# Altium schematic sheet [4] Signals.SchDoc
size A4; SheetNumber: 5; SheetTotal: 6
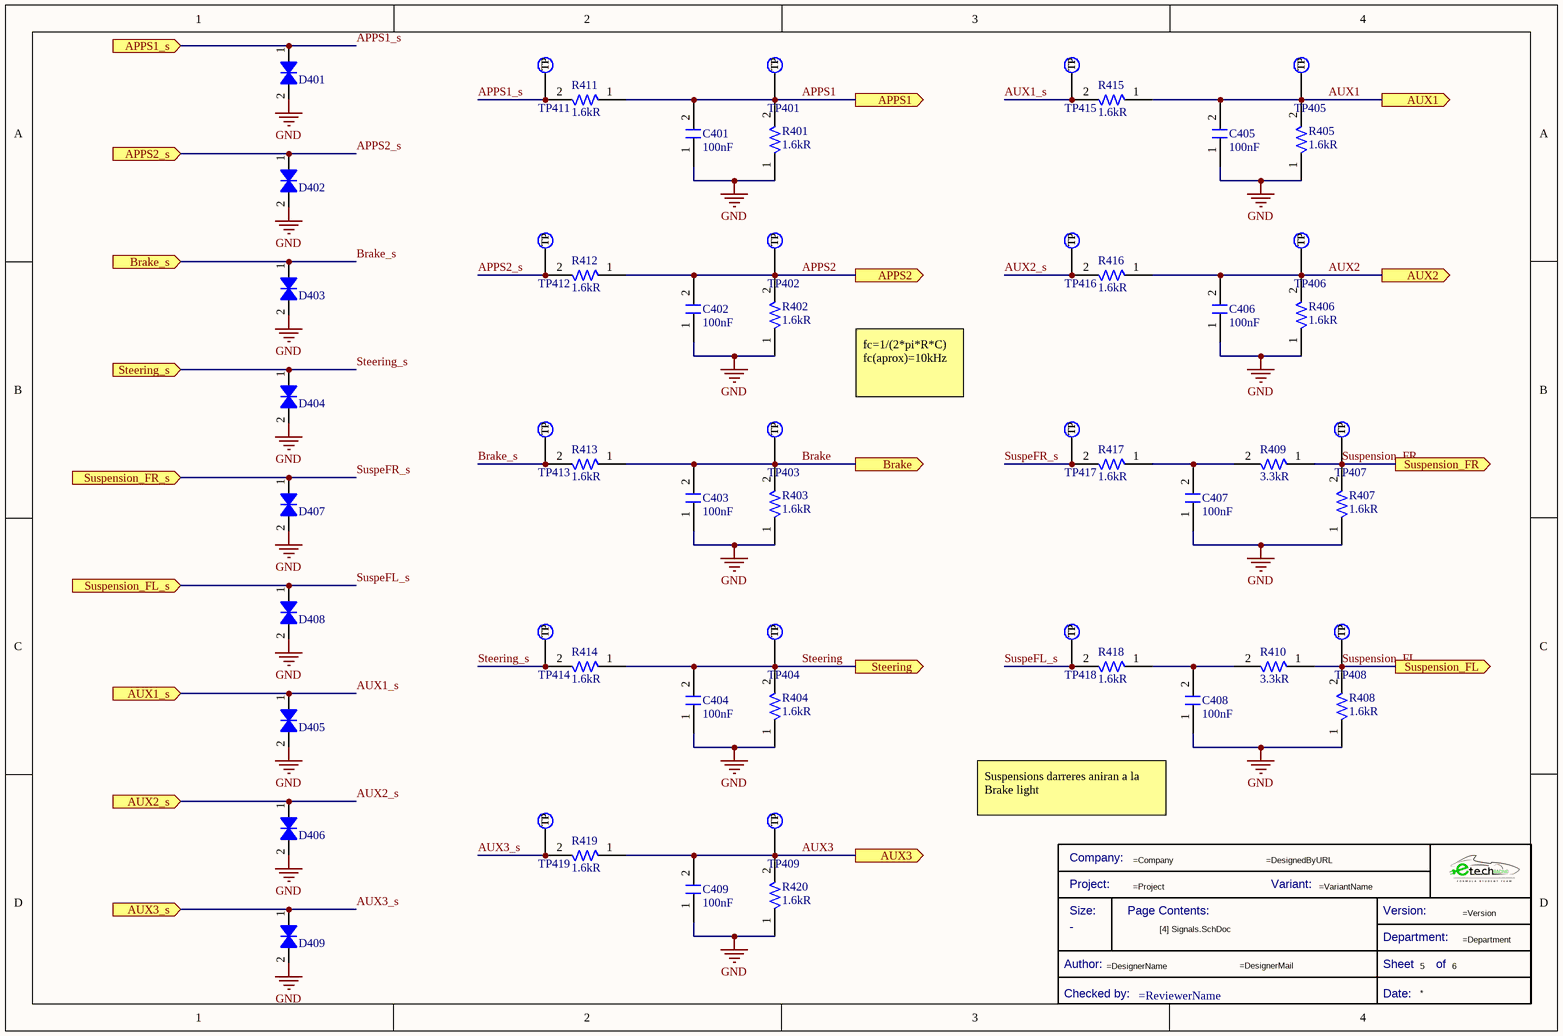
[diagram p0: [4] Signals.SchDoc]

## Parts
*  Title Block_template  (value not drawn)  (graphical)
C401  Capacitance: 100nF  [C1206FNPC-RW]  (hidden comment: 885012208009)
C402  Capacitance: 100nF  [C1206FNPC-RW]  (hidden comment: 885012208009)
C403  Capacitance: 100nF  [C1206FNPC-RW]  (hidden comment: 885012208009)
C404  Capacitance: 100nF  [C1206FNPC-RW]  (hidden comment: 885012208009)
C405  Capacitance: 100nF  [C1206FNPC-RW]  (hidden comment: 885012208009)
C406  Capacitance: 100nF  [C1206FNPC-RW]  (hidden comment: 885012208009)
C407  Capacitance: 100nF  [C1206FNPC-RW]  (hidden comment: 885012208009)
C408  Capacitance: 100nF  [C1206FNPC-RW]  (hidden comment: 885012208009)
C409  Capacitance: 100nF  [C1206FNPC-RW]  (hidden comment: 885012208009)
D401  824501600  [DTVS-DO-214AC]  (value not drawn)
D402  824501600  [DTVS-DO-214AC]  (value not drawn)
D403  824501600  [DTVS-DO-214AC]  (value not drawn)
D404  824501600  [DTVS-DO-214AC]  (value not drawn)
D405  824501600  [DTVS-DO-214AC]  (value not drawn)
D406  824501600  [DTVS-DO-214AC]  (value not drawn)
D407  824501600  [DTVS-DO-214AC]  (value not drawn)
D408  824501600  [DTVS-DO-214AC]  (value not drawn)
D409  824501600  [DTVS-DO-214AC]  (value not drawn)
R401  Resistance: 1.6kR  [R1206FTK-W]  (hidden comment: CRCW12061K60FKEA)
R402  Resistance: 1.6kR  [R1206FTK-W]  (hidden comment: CRCW12061K60FKEA)
R403  Resistance: 1.6kR  [R1206FTK-W]  (hidden comment: CRCW12061K60FKEA)
R404  Resistance: 1.6kR  [R1206FTK-W]  (hidden comment: CRCW12061K60FKEA)
R405  Resistance: 1.6kR  [R1206FTK-W]  (hidden comment: CRCW12061K60FKEA)
R406  Resistance: 1.6kR  [R1206FTK-W]  (hidden comment: CRCW12061K60FKEA)
R407  Resistance: 1.6kR  [R1206FTK-W]  (hidden comment: CRCW12064K30FKEA)
R408  Resistance: 1.6kR  [R1206FTK-W]  (hidden comment: CRCW12064K30FKEA)
R409  Resistance: 3.3kR  [R1206FTK-W]  (hidden comment: CRCW12066K19FKEA)
R410  Resistance: 3.3kR  [R1206FTK-W]  (hidden comment: CRCW12066K19FKEA)
R411  Resistance: 1.6kR  [R1206FTK-W]  (hidden comment: CRCW12061K60FKEA)
R412  Resistance: 1.6kR  [R1206FTK-W]  (hidden comment: CRCW12061K60FKEA)
R413  Resistance: 1.6kR  [R1206FTK-W]  (hidden comment: CRCW12061K60FKEA)
R414  Resistance: 1.6kR  [R1206FTK-W]  (hidden comment: CRCW12061K60FKEA)
R415  Resistance: 1.6kR  [R1206FTK-W]  (hidden comment: CRCW12061K60FKEA)
R416  Resistance: 1.6kR  [R1206FTK-W]  (hidden comment: CRCW12061K60FKEA)
R417  Resistance: 1.6kR  [R1206FTK-W]  (hidden comment: CRCW12061K60FKEA)
R418  Resistance: 1.6kR  [R1206FTK-W]  (hidden comment: CRCW12061K60FKEA)
R419  Resistance: 1.6kR  [R1206FTK-W]  (hidden comment: CRCW12061K60FKEA)
R420  Resistance: 1.6kR  [R1206FTK-W]  (hidden comment: CRCW12061K60FKEA)
TP401  TestPoint  [TestPoint]  (value not drawn)  (no BOM)
TP402  TestPoint  [TestPoint]  (value not drawn)  (no BOM)
TP403  TestPoint  [TestPoint]  (value not drawn)  (no BOM)
TP404  TestPoint  [TestPoint]  (value not drawn)  (no BOM)
TP405  TestPoint  [TestPoint]  (value not drawn)  (no BOM)
TP406  TestPoint  [TestPoint]  (value not drawn)  (no BOM)
TP407  TestPoint  [TestPoint]  (value not drawn)  (no BOM)
TP408  TestPoint  [TestPoint]  (value not drawn)  (no BOM)
TP409  TestPoint  [TestPoint]  (value not drawn)  (no BOM)
TP411  TestPoint  [TestPoint]  (value not drawn)  (no BOM)
TP412  TestPoint  [TestPoint]  (value not drawn)  (no BOM)
TP413  TestPoint  [TestPoint]  (value not drawn)  (no BOM)
TP414  TestPoint  [TestPoint]  (value not drawn)  (no BOM)
TP415  TestPoint  [TestPoint]  (value not drawn)  (no BOM)
TP416  TestPoint  [TestPoint]  (value not drawn)  (no BOM)
TP417  TestPoint  [TestPoint]  (value not drawn)  (no BOM)
TP418  TestPoint  [TestPoint]  (value not drawn)  (no BOM)
TP419  TestPoint  [TestPoint]  (value not drawn)  (no BOM)

## Ports
APPS1 (out), APPS1_s (in), APPS2 (out), APPS2_s (in), AUX1 (out), AUX1_s (in), AUX2 (out), AUX2_s (in), AUX3 (out), AUX3_s (in), Brake (out), Brake_s (in), Steering (out), Steering_s (in), Suspension_FL (out), Suspension_FL_s (in), Suspension_FR (out), Suspension_FR_s (in)

## Nets
GND: C401.1 C402.1 C403.1 C404.1 C405.1 C406.1 C407.1 C408.1 C409.1 D401.2 D402.2 D403.2 D404.2 D405.2 D406.2 D407.2 D408.2 D409.2 R401.1 R402.1 R403.1 R404.1 R405.1 R406.1 R407.1 R408.1 R420.1
APPS1: C401.2 R401.2 R411.1 TP401.1(TP) ; port APPS1
APPS1_s: D401.1 R411.2 TP411.1(TP) ; port APPS1_s
APPS2: C402.2 R402.2 R412.1 TP402.1(TP) ; port APPS2
APPS2_s: D402.1 R412.2 TP412.1(TP) ; port APPS2_s
AUX1: C405.2 R405.2 R415.1 TP405.1(TP) ; port AUX1
AUX1_s: D405.1 R415.2 TP415.1(TP) ; port AUX1_s
AUX2: C406.2 R406.2 R416.1 TP406.1(TP) ; port AUX2
AUX2_s: D406.1 R416.2 TP416.1(TP) ; port AUX2_s
AUX3: C409.2 R419.1 R420.2 TP409.1(TP) ; port AUX3
AUX3_s: D409.1 R419.2 TP419.1(TP) ; port AUX3_s
Brake: C403.2 R403.2 R413.1 TP403.1(TP) ; port Brake
Brake_s: D403.1 R413.2 TP413.1(TP) ; port Brake_s
Steering: C404.2 R404.2 R414.1 TP404.1(TP) ; port Steering
Steering_s: D404.1 R414.2 TP414.1(TP) ; port Steering_s
SuspeFL_s: D408.1 R418.2 TP418.1(TP) ; port Suspension_FL_s
SuspeFR_s: D407.1 R417.2 TP417.1(TP) ; port Suspension_FR_s
Suspension_FL: R408.2 R410.1 TP408.1(TP) ; port Suspension_FL
Suspension_FR: R407.2 R409.1 TP407.1(TP) ; port Suspension_FR
NetC407_2: C407.2 R409.2 R417.1
NetC408_2: C408.2 R410.2 R418.1

## Notes on the sheet
- fc=1/(2*pi*R*C)
  fc(aprox)=10kHz
- Suspensions darreres aniran a la Brake light
- (in symbol Title Block_template) Company:; Project:; Variant:; Size:; Page Contents:; Version:; Department:; Author:; Sheet; of; Checked by:; Date:

## Library data of the parts
* = Title Block_template: Standard Title Block; .Creator: GP; Category: Title Block; .PCBcheck: GP; .SCHcheck: GP; Checked by:: =ReviewerName; Size: -
C401-C409 = C100n-10V-1206FNPC-X7R: Cap, 0.1ΜF, 10V, 10%, X7R, 1206; Manufacturer 1: Wurth Electronics; Supplier 1: Digi-Key; Manufacturer Part Number 1: 885012208009; RoHS: Yes; Category: Ceramic Capacitors; Stock 1: 7198; Pricing 1: 1=0,11000, 10=0,10300, 100=0,09200, 500=0,08100 (USD); Mount: Surface Mount; Case/Package: 1206; Case Code (Metric): 3216; Case Code (Imperial): 1206; Min Operating Temperature: -55°C; Max Operating Temperature: 125°C; Packaging: Tape and Reel; Voltage Rating: 10V; Tolerance: 10%; Length: 0.126inch; Width: 0.063inch; Thickness: 0.035inch; RoHS Compliant: Yes; ComponentLink1URL: http://www.farnell.com/datasheets/2031891.pdf?src-supplier=Farnell; ComponentLink1Description: http://www.farnell.com/datasheets/2031891.pdf?src-supplier=Farnell; ComponentLink2URL: http://katalog.we-online.de/pbs/datasheet/885012208009.pdf?src-supplier=Digi-Key; ComponentLink2Description: http://katalog.we-online.de/pbs/datasheet/885012208009.pdf?src-supplier=Digi-Key; ComponentLink3URL: https://katalog.we-online.de/pbs/datasheet/885012208009.pdf?src-supplier=Digi-Key; ComponentLink3Description: https://katalog.we-online.de/pbs/datasheet/885012208009.pdf?src-supplier=Digi-Key; Supplier Part Number 1: 732-8086-1-ND; ComponentLink4Description: Wurth Elektronik; ComponentLink4URL: https://www.we-online.com/catalog/en/WCAP-CSGP-10VDC?sq=885012208009#885012208009
D401-D409 = DTVS-6V-DO-214AC: TVS diode [Würth Elektronik] 824501600 TVS diode; Manufacturer: Wurth Electronics; Number of Bidirectional Channels: 1; Reverse Standoff Voltage: 6V; Min Breakdown Voltage: 7.02V; Clamping Voltage: 10.3V; Peak Pulse Power: 400W; Power Line Protection: No; Polarity: Bidirectional; Peak Pulse Current: 38.8A; ComponentLink1Description: Where buy it; ComponentLink1URL: https://www.we-online.com/catalog/en/WE-TVSP?sq=824501600#824501600; Supplier 1: Mouser; Manufacturer Part Number: 824501600; RoHS: Yes; Category: TVS Diodes; Stock 1: 780; Pricing 1: 1=0,28000, 10=0,26100, 50=0,26100, 100=0,23400, 500=0,20400, 1000=0,17400, 10000=0,17400 (USD); Mount: Surface Mount; Number of Pins: 2; Min Operating Temperature: -65°C; Max Operating Temperature: 150°C; Packaging: Cut Tape; Max Breakdown Voltage: 7.02V; Resistor Type: Zener; REACH SVHC: Unknown; RoHS Compliant: Yes; ComponentLink2URL: http://www.farnell.com/datasheets/2036401.pdf?src-supplier=Element14; ComponentLink2Description: http://www.farnell.com/datasheets/2036401.pdf?src-supplier=Element14; Supplier Part Number 1: 710-824501600; ComponentLink3URL: https://katalog.we-online.de/pbs/datasheet/824501600.pdf?src-supplier=Digi-Key; ComponentLink3Description: https://katalog.we-online.de/pbs/datasheet/824501600.pdf?src-supplier=Digi-Key
R401-R406 R411-R420 = R1.6K-1206FTK: Res Thick Film 1206 1.6K Ohm 1% 1/4W ±100ppm/°C Molded SMD SMD Paper T/R; Manufacturer 1: Vishay; Max Power Dissipation: 250mW; Voltage Rating: 200V; Supplier 1: Digi-Key; Manufacturer Part Number 1: CRCW12061K60FKEA; RoHS: Yes; Category: Chip SMD Resistors; Pricing 1: 1=0,10000, 10=0,08200, 100=0,03160, 1000=0,01392, 2500=0,01202 (USD); Case/Package: 1206; Number of Pins: 2; Contact Plating: Tin; Case Code (Metric): 3216; Case Code (Imperial): 1206; Weight: 0.000353oz; Size Code: 1206; Min Operating Temperature: -55°C; Max Operating Temperature: 155°C; Tolerance: 1%; Resistor Type: Thick Film; Temperature Coefficient: 100ppm/°C; Package Quantity: 5000; Packaging: Tape and Reel; Number of Terminations: 2; Features: Automotive AEC-Q200; Series: CRCW; Power Rating: 250mW; Termination: SMD/SMT; Voltage Rating (DC): 200V; Resistance Tolerance: 1%; Technology: THICK FILM; Construction: Rectangular; Length: 3.2mm; Width: 0.063inch; Height: 0.55mm; Depth: 1.6mm; Radiation Hardening: No; Lead Free: Lead Free; RoHS Compliant: Yes; REACH SVHC: Unknown; Military Standard: Not; ComponentLink1URL: https://datasheet.ciiva.com/11811/0900766b80d98b5e-11811377.pdf?src-supplier=RSComponents; ComponentLink1Description: https://datasheet.ciiva.com/11811/0900766b80d98b5e-11811377.pdf?src-supplier=RSComponents; ComponentLink2URL: https://datasheet.ciiva.com/2515/dcrcwe3-2515616.pdf?src-supplier=Digi-Key; ComponentLink2Description: https://datasheet.ciiva.com/2515/dcrcwe3-2515616.pdf?src-supplier=Digi-Key; ComponentLink3URL: https://datasheet.ciiva.com/2515/dcrcwe3-2515617.pdf?src-supplier=Digi-Key; ComponentLink3Description: https://datasheet.ciiva.com/2515/dcrcwe3-2515617.pdf?src-supplier=Digi-Key; ComponentLink4URL: https://datasheet.ciiva.com/2515/dcrcwe3-2515618.pdf?src-supplier=Digi-Key; ComponentLink4Description: https://datasheet.ciiva.com/2515/dcrcwe3-2515618.pdf?src-supplier=Digi-Key; ComponentLink5URL: https://datasheet.ciiva.com/9098/dcrcwe3-9098889.pdf?src-supplier=Avnet; ComponentLink5Description: https://datasheet.ciiva.com/9098/dcrcwe3-9098889.pdf?src-supplier=Avnet; ComponentLink6URL: https://datasheet.ciiva.com/16213/dcrcwe3-16213498.pdf?src-supplier=Future+Electronics; ComponentLink6Description: https://datasheet.ciiva.com/16213/dcrcwe3-16213498.pdf?src-supplier=Future+Electronics; ComponentLink7URL: https://datasheet.ciiva.com/17203/dcrcwe3-17203786.pdf?src-supplier=Avnet+Europe; ComponentLink7Description: https://datasheet.ciiva.com/17203/dcrcwe3-17203786.pdf?src-supplier=Avnet+Europe; ComponentLink8URL: https://datasheet.ciiva.com/7670/1697337-7670316.pdf?src-supplier=Element14; ComponentLink8Description: https://datasheet.ciiva.com/7670/1697337-7670316.pdf?src-supplier=Element14; ComponentLink9URL: https://datasheet.ciiva.com/7670/1697337-7670317.pdf?src-supplier=Element14; ComponentLink9Description: https://datasheet.ciiva.com/7670/1697337-7670317.pdf?src-supplier=Element14; ComponentLink10URL: https://datasheet.ciiva.com/5550/dcrcwe3-109170-5550718.pdf?src-supplier=Mouser; ComponentLink10Description: https://datasheet.ciiva.com/5550/dcrcwe3-109170-5550718.pdf?src-supplier=Mouser; Supplier Part Number 1: 541-1.60KFCT-ND; ComponentLink11Description: RS; ComponentLink11URL: https://es.rs-online.com/web/p/resistencias-fijas-para-montaje-en-superficie/6791866/
R407 R408 = R4.3K-1206FTK: Res Thick Film 1206 4.3K Ohm 1% 1/4W ±100ppm/°C Molded SMD SMD Paper T/R; Manufacturer 1: Vishay; Power Rating: 250mW; Voltage Rating: 200V; Supplier 1: Digi-Key; Manufacturer Part Number 1: CRCW12064K30FKEA; RoHS: Yes; Category: Chip SMD Resistors; Pricing 1: 1=0,10000, 10=0,08200, 100=0,03160, 1000=0,01392, 2500=0,01202 (USD); Case/Package: 1206; Number of Pins: 2; Contact Plating: Tin; Weight: 0.000353oz; Case Code (Metric): 3216; Case Code (Imperial): 1206; Min Operating Temperature: -55°C; Max Operating Temperature: 155°C; Tolerance: 1%; Resistor Type: Thick Film; Temperature Coefficient: 100ppm/°C; Packaging: Tape and Reel; Number of Terminations: 2; Termination: SMD/SMT; Max Power Dissipation: 250mW; Features: Automotive AEC-Q200; Series: CRCW; Package Quantity: 10; Voltage Rating (DC): 200V; Resistance Tolerance: 1%; Construction: Rectangular; Technology: THICK FILM; Length: 3.2mm; Width: 0.063inch; Height: 0.55mm; Depth: 1.6mm; Radiation Hardening: No; Lead Free: Lead Free; RoHS Compliant: Yes; REACH SVHC: Unknown; Military Standard: Not; ComponentLink1URL: https://datasheet.ciiva.com/11811/0900766b80d98b5e-11811783.pdf?src-supplier=RSComponents; ComponentLink1Description: https://datasheet.ciiva.com/11811/0900766b80d98b5e-11811783.pdf?src-supplier=RSComponents; ComponentLink2URL: https://datasheet.ciiva.com/2497/dcrcwe3-2497360.pdf?src-supplier=Digi-Key; ComponentLink2Description: https://datasheet.ciiva.com/2497/dcrcwe3-2497360.pdf?src-supplier=Digi-Key; ComponentLink3URL: https://datasheet.ciiva.com/2497/dcrcwe3-2497361.pdf?src-supplier=Digi-Key; ComponentLink3Description: https://datasheet.ciiva.com/2497/dcrcwe3-2497361.pdf?src-supplier=Digi-Key; ComponentLink4URL: https://datasheet.ciiva.com/2497/dcrcwe3-2497362.pdf?src-supplier=Digi-Key; ComponentLink4Description: https://datasheet.ciiva.com/2497/dcrcwe3-2497362.pdf?src-supplier=Digi-Key; ComponentLink5URL: https://datasheet.ciiva.com/7679/1533075-7679286.pdf?src-supplier=Element14; ComponentLink5Description: https://datasheet.ciiva.com/7679/1533075-7679286.pdf?src-supplier=Element14; ComponentLink6URL: https://datasheet.ciiva.com/5562/dcrcwe3-109170-5562219.pdf?src-supplier=Mouser; ComponentLink6Description: https://datasheet.ciiva.com/5562/dcrcwe3-109170-5562219.pdf?src-supplier=Mouser; ComponentLink7URL: https://datasheet.ciiva.com/17196/dcrcwe3-17196843.pdf?src-supplier=Avnet+Europe; ComponentLink7Description: https://datasheet.ciiva.com/17196/dcrcwe3-17196843.pdf?src-supplier=Avnet+Europe; ComponentLink8URL: https://datasheet.ciiva.com/7679/1697337-7679213.pdf?src-supplier=Element14; ComponentLink8Description: https://datasheet.ciiva.com/7679/1697337-7679213.pdf?src-supplier=Element14; ComponentLink9URL: https://datasheet.ciiva.com/9073/dcrcwe3-9073935.pdf?src-supplier=Avnet; ComponentLink9Description: https://datasheet.ciiva.com/9073/dcrcwe3-9073935.pdf?src-supplier=Avnet; Supplier Part Number 1: 541-4.30KFCT-ND; ComponentLink10Description: RS; ComponentLink10URL: https://es.rs-online.com/web/p/resistencias-fijas-para-montaje-en-superficie/6792187/
R409 R410 = R6.2K-1206FTK: Res Thick Film 1206 6.19K Ohm 1% 1/4W ±100ppm/°C Molded SMD SMD Paper T/R; Manufacturer 1: Vishay; Power Rating: 250mW; Voltage Rating: 200V; Supplier 1: Digi-Key; Manufacturer Part Number 1: CRCW12066K19FKEA; RoHS: Yes; Category: Chip SMD Resistors; Stock 1: 66; Pricing 1: 1=0,10000, 10=0,08200, 100=0,03160, 1000=0,01392, 2500=0,01202 (USD); Case/Package: 1206; Contact Plating: Tin; Weight: 0.000353oz; Case Code (Imperial): 1206; Case Code (Metric): 3216; Min Operating Temperature: -55°C; Max Operating Temperature: 155°C; Tolerance: 1%; Temperature Coefficient: 100ppm/°C; Packaging: Tape and Reel; Resistor Type: Thick Film; Number of Terminations: 2; Max Power Dissipation: 250mW; Features: Automotive AEC-Q200; Series: CRCW; Package Quantity: 10; Termination: SMD/SMT; Voltage Rating (DC): 200V; Resistance Tolerance: 1%; Technology: THICK FILM; Construction: Rectangular; Length: 3.2mm; Width: 1.6mm; Height: 0.55mm; Depth: 1.6mm; Radiation Hardening: No; Lead Free: Lead Free; RoHS Compliant: Yes; REACH SVHC: Unknown; Military Standard: Not; ComponentLink1URL: https://datasheet.ciiva.com/11818/0900766b80d98b5e-11818251.pdf?src-supplier=RSComponents; ComponentLink1Description: https://datasheet.ciiva.com/11818/0900766b80d98b5e-11818251.pdf?src-supplier=RSComponents; ComponentLink2URL: https://datasheet.ciiva.com/17193/dcrcwe3-17193575.pdf?src-supplier=Avnet+Europe; ComponentLink2Description: https://datasheet.ciiva.com/17193/dcrcwe3-17193575.pdf?src-supplier=Avnet+Europe; ComponentLink3URL: https://datasheet.ciiva.com/2496/dcrcwe3-2496955.pdf?src-supplier=Digi-Key; ComponentLink3Description: https://datasheet.ciiva.com/2496/dcrcwe3-2496955.pdf?src-supplier=Digi-Key; ComponentLink4URL: https://datasheet.ciiva.com/2496/dcrcwe3-2496956.pdf?src-supplier=Digi-Key; ComponentLink4Description: https://datasheet.ciiva.com/2496/dcrcwe3-2496956.pdf?src-supplier=Digi-Key; ComponentLink5URL: https://datasheet.ciiva.com/16201/dcrcwe3-16201468.pdf?src-supplier=Future+Electronics; ComponentLink5Description: https://datasheet.ciiva.com/16201/dcrcwe3-16201468.pdf?src-supplier=Future+Electronics; ComponentLink6URL: https://datasheet.ciiva.com/2496/dcrcwe3-2496957.pdf?src-supplier=Digi-Key; ComponentLink6Description: https://datasheet.ciiva.com/2496/dcrcwe3-2496957.pdf?src-supplier=Digi-Key; Supplier Part Number 1: 541-6.19KFCT-ND; ComponentLink7Description: RS; ComponentLink7URL: https://es.rs-online.com/web/p/resistencias-fijas-para-montaje-en-superficie/6792291/
TP401-TP409 TP411-TP419 = TestPoint: Test Point 1x1 mm; Category: TestPoint